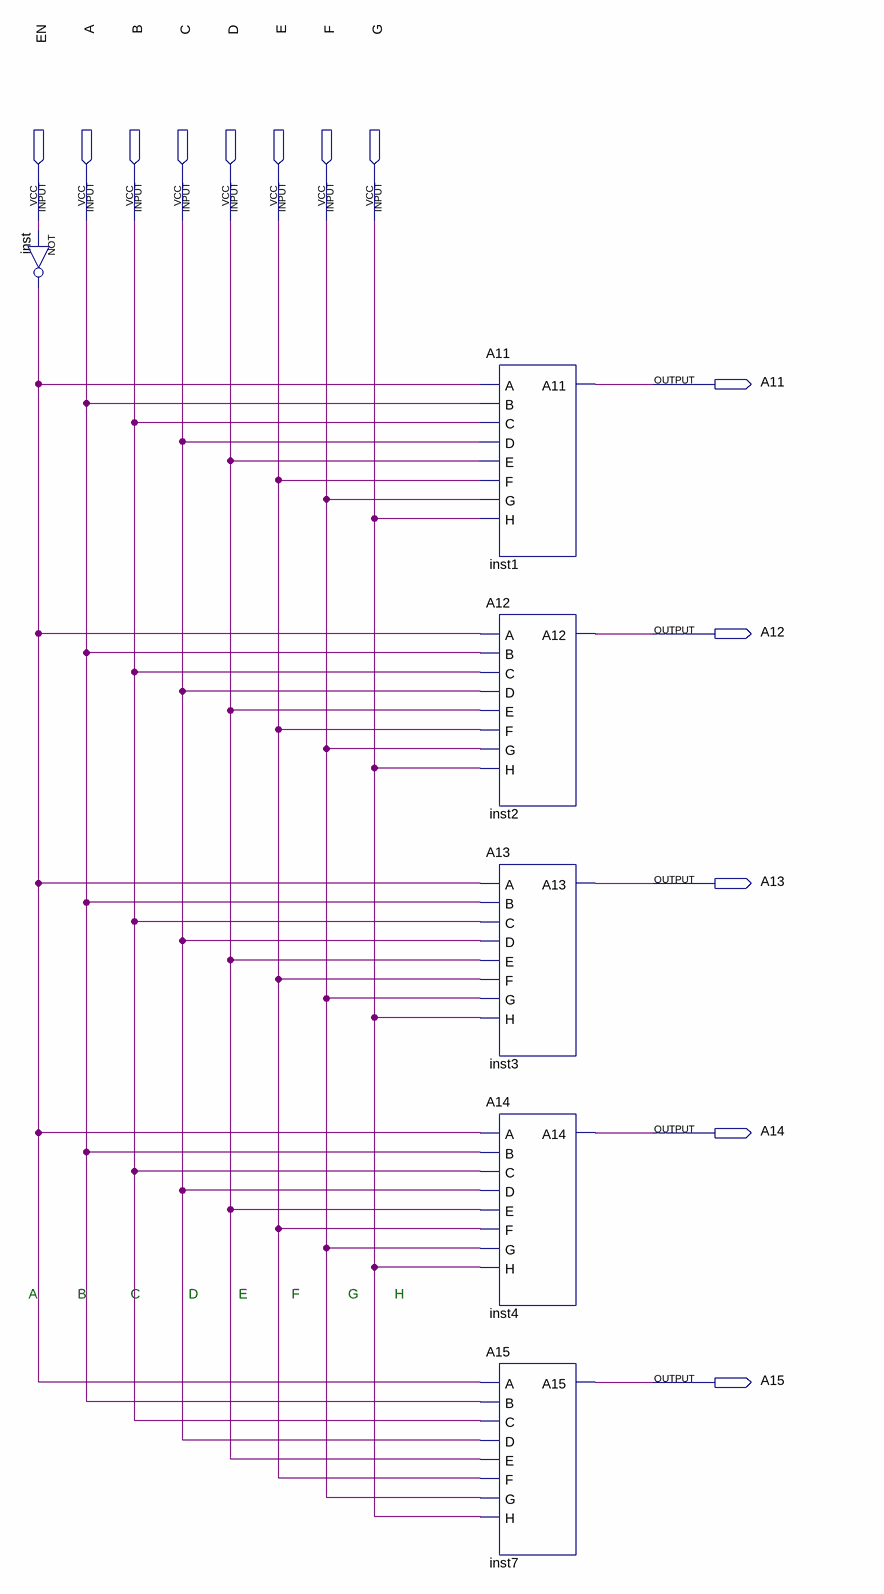
[diagram p0: schematic sheet]
// Quartus schematic Linha1.bdf as structural Verilog: 6 symbols, 13 pins
module Linha1 (
  input  EN,
  input  A,
  input  B,
  input  C,
  input  D,
  input  E,
  input  F,
  input  G,
  output A11,
  output A12,
  output A13,
  output A14,
  output A15
);

  wire inst_out;

  not inst (inst_out, EN);
  A11 inst1 (.A(inst_out), .B(A), .C(B), .D(C), .E(D), .F(E), .G(F), .H(G), .A11(A11));
  A12 inst2 (.A(inst_out), .B(A), .C(B), .D(C), .E(D), .F(E), .G(F), .H(G), .A12(A12));
  A13 inst3 (.A(inst_out), .B(A), .C(B), .D(C), .E(D), .F(E), .G(F), .H(G), .A13(A13));
  A14 inst4 (.A(inst_out), .B(A), .C(B), .D(C), .E(D), .F(E), .G(F), .H(G), .A14(A14));
  A15 inst7 (.A(inst_out), .B(A), .C(B), .D(C), .E(D), .F(E), .G(F), .H(G), .A15(A15));

  // Notes on the sheet:
  //   A          B           C            D          E           F            G         H
endmodule
